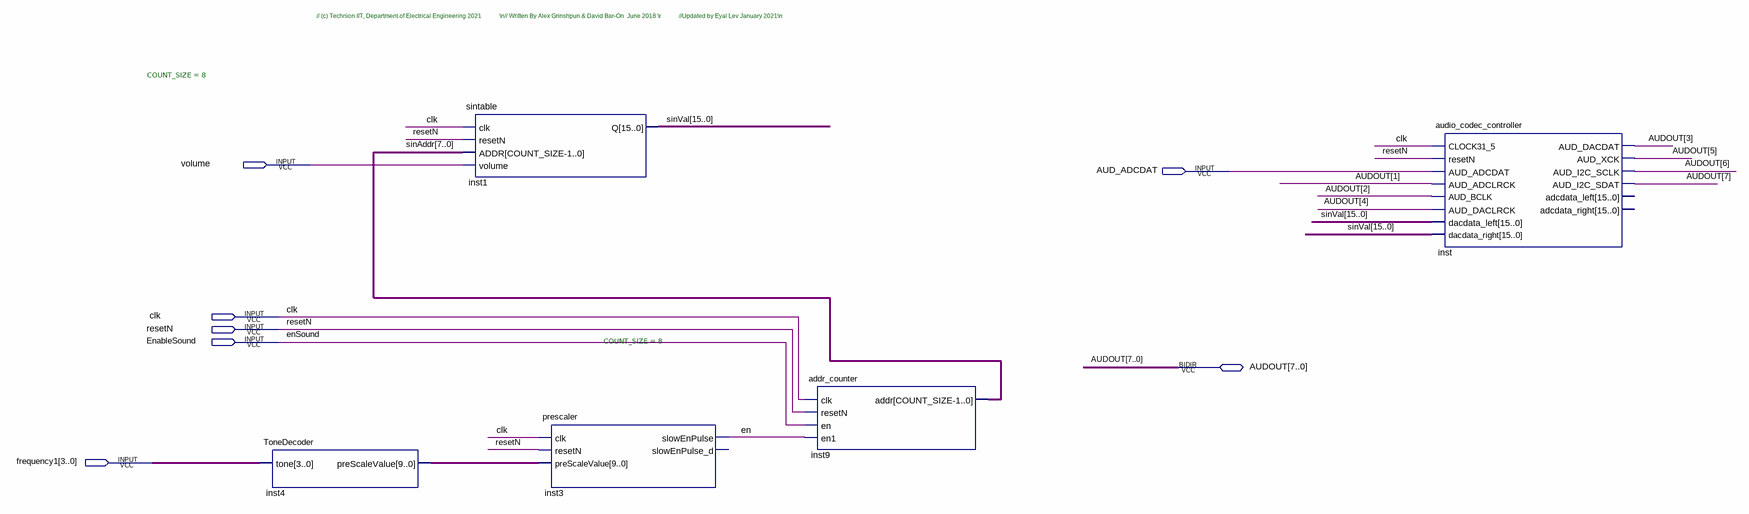
[diagram p0: schematic sheet]
// Quartus schematic AUDIO.bdf as structural Verilog: 5 symbols, 7 pins
module AUDIO (
  input  volume,
  input  AUD_ADCDAT,
  input  clk,
  input  resetN,
  input  EnableSound,
  input  [3:0] frequency1,
  inout  [7:0] AUDOUT
);

  wire en;
  wire [7:0] sinAddr;
  wire [9:0] inst4_prescalevalue;
  wire [15:0] sinVal;

  ToneDecoder inst4 (.tone(frequency1), .preScaleValue(inst4_prescalevalue));
  sintable #(.COUNT_SIZE(8)) inst1 (.clk(clk), .resetN(resetN), .ADDR(sinAddr), .volume(volume), .Q(sinVal));
  prescaler inst3 (
    .clk(clk), .resetN(resetN), .preScaleValue(inst4_prescalevalue), .slowEnPulse(en));  // open: slowEnPulse_d
  addr_counter #(.COUNT_SIZE(8)) inst9 (.clk(clk), .resetN(resetN), .en(EnableSound), .en1(en), .addr(sinAddr));
  audio_codec_controller inst (
    .CLOCK31_5(clk), .resetN(resetN), .AUD_ADCDAT(AUD_ADCDAT), .AUD_ADCLRCK(AUDOUT[1]), .AUD_BCLK(AUDOUT[2]),
    .AUD_DACLRCK(AUDOUT[4]), .dacdata_left(sinVal), .dacdata_right(sinVal), .AUD_DACDAT(AUDOUT[3]),
    .AUD_XCK(AUDOUT[5]), .AUD_I2C_SCLK(AUDOUT[6]), .AUD_I2C_SDAT(AUDOUT[7]));  // open: adcdata_left, adcdata_right

  // Other names for the same wires on the sheet: enSound = EnableSound

  // Notes on the sheet:
  //   // (c) Technion IIT, Department of Electrical Engineering 2021            \n// Written By Alex Grinshpun & David Bar-On  June 2018 \r            //Updated by Eyal Lev January 2021\n
endmodule
